# Altium schematic sheet Sheet1.SchDoc
size A4; SheetNumber: 1; SheetTotal: 1
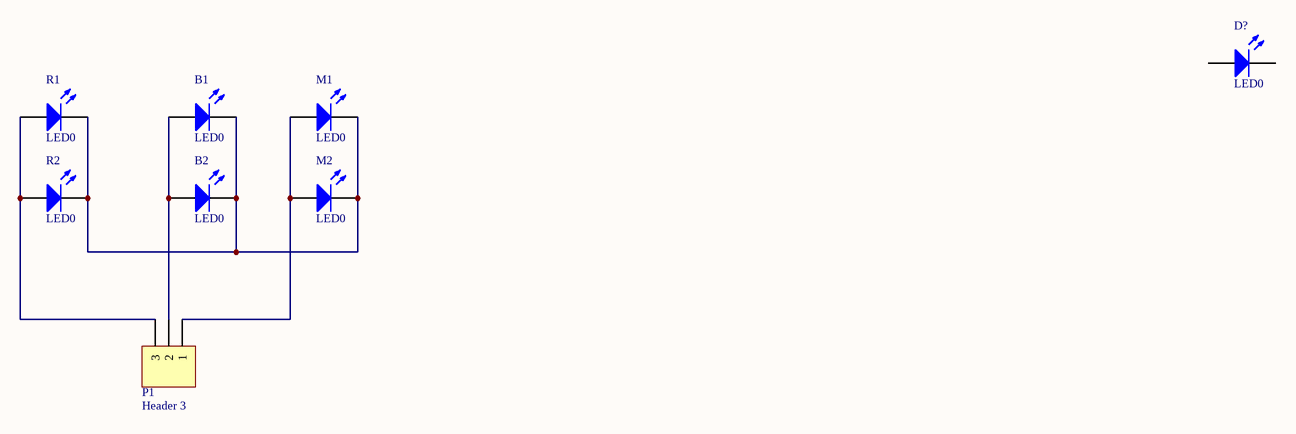
[diagram p0: Sheet1.SchDoc]

## Parts
B1  LED0  [LED-0]
B2  LED0  [LED-0]
D?  LED0  [LED-0]
M1  LED0  [LED-0]
M2  LED0  [LED-0]
P1  Header 3  [HDR1X3]
R1  LED0  [LED-0]
R2  LED0  [LED-0]

## Nets
NetB1_1: B1.1(A) B2.1(A) P1.2
NetB1_2: B1.2(K) B2.2(K) M1.2(K) M2.2(K) R1.2(K) R2.2(K)
NetM1_1: M1.1(A) M2.1(A) P1.1
NetP1_3: P1.3 R1.1(A) R2.1(A)

Not connected (* = marked no-connect by the designer): D? 1(A) 2(K)

## Library data of the parts
B1 B2 D? M1 M2 R1 R2 = LED0: Typical INFRARED GaAs LED; Published: 8-Jun-2000; LatestRevisionDate: 08-Jul-2005; LatestRevisionNote: Mech Layer 1 removed.; PackageReference: LED-0; Publisher: Altium Limited; PackageDescription: LED; 2 Leads
P1 = Header 3: Header, 3-Pin; LatestRevisionDate: 17-Jul-2002; LatestRevisionNote: Re-released for DXP Platform.; Publisher: Altium Limited